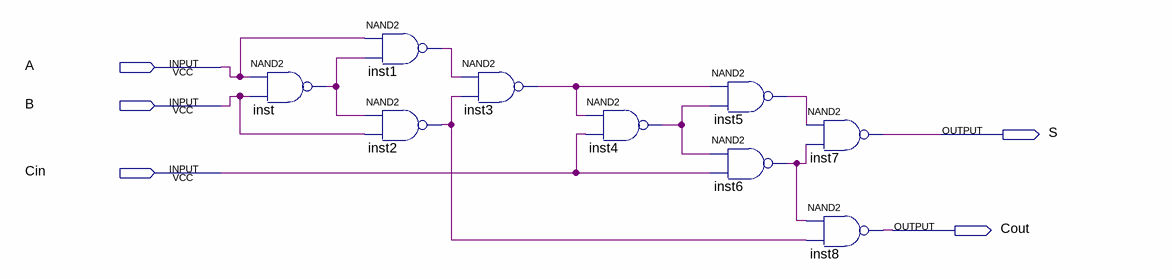
[diagram p0: schematic sheet]
// Quartus schematic substractor.bdf as structural Verilog: 9 symbols, 5 pins
module substractor (
  input  A,
  input  B,
  input  Cin,
  output S,
  output Cout
);

  wire inst1_out, inst2_out, inst3_out, inst4_out, inst5_out, inst6_out, inst_out;

  nand inst (inst_out, A, B);
  nand inst1 (inst1_out, A, inst_out);
  nand inst2 (inst2_out, inst_out, B);
  nand inst3 (inst3_out, inst1_out, inst2_out);
  nand inst4 (inst4_out, inst3_out, Cin);
  nand inst5 (inst5_out, inst3_out, inst4_out);
  nand inst6 (inst6_out, inst4_out, Cin);
  nand inst7 (S, inst5_out, inst6_out);
  nand inst8 (Cout, inst6_out, inst2_out);
endmodule
